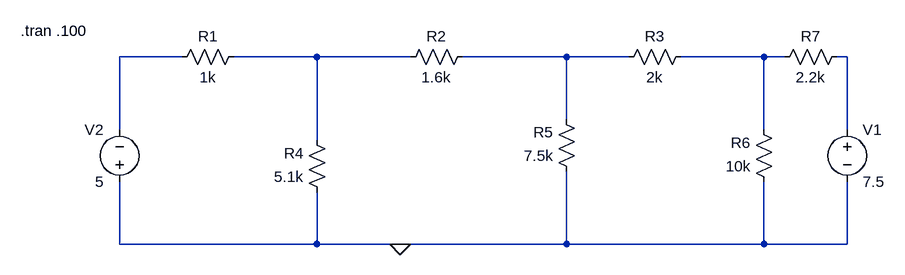
[diagram p0: schematic circuit2.asc]
circuit2.asc, the LTspice schematic file:
Version 4.1
SHEET 1 1008 680
WIRE -80 48 -176 48
WIRE 128 48 0 48
WIRE 272 48 128 48
WIRE 512 48 352 48
WIRE 608 48 512 48
WIRE 816 48 688 48
WIRE 848 48 816 48
WIRE 944 48 928 48
WIRE 512 144 512 48
WIRE -176 160 -176 48
WIRE 816 160 816 48
WIRE 944 160 944 48
WIRE 128 176 128 48
WIRE -176 336 -176 240
WIRE 128 336 128 256
WIRE 128 336 -176 336
WIRE 256 336 128 336
WIRE 512 336 512 224
WIRE 512 336 256 336
WIRE 816 336 816 240
WIRE 816 336 512 336
WIRE 944 336 944 240
WIRE 944 336 816 336
FLAG 256 336 0
SYMBOL res 16 32 R90
WINDOW 0 0 56 VBottom 2
WINDOW 3 32 56 VTop 2
SYMATTR InstName R1
SYMATTR Value 1k
SYMBOL res 368 32 R90
WINDOW 0 0 56 VBottom 2
WINDOW 3 32 56 VTop 2
SYMATTR InstName R2
SYMATTR Value 1.6k
SYMBOL res 704 32 R90
WINDOW 0 0 56 VBottom 2
WINDOW 3 32 56 VTop 2
SYMATTR InstName R3
SYMATTR Value 2k
SYMBOL res 144 272 R180
WINDOW 0 36 76 Left 2
WINDOW 3 36 40 Left 2
SYMATTR InstName R4
SYMATTR Value 5.1k
SYMBOL res 528 240 R180
WINDOW 0 36 76 Left 2
WINDOW 3 36 40 Left 2
SYMATTR InstName R5
SYMATTR Value 7.5k
SYMBOL res 832 256 R180
WINDOW 0 36 76 Left 2
WINDOW 3 36 40 Left 2
SYMATTR InstName R6
SYMATTR Value 10k
SYMBOL voltage 944 144 R0
WINDOW 123 0 0 Left 0
WINDOW 39 0 0 Left 0
SYMATTR InstName V1
SYMATTR Value 7.5
SYMBOL res 944 32 R90
WINDOW 0 0 56 VBottom 2
WINDOW 3 32 56 VTop 2
SYMATTR InstName R7
SYMATTR Value 2.2k
SYMBOL voltage -176 256 R180
WINDOW 0 24 96 Left 2
WINDOW 3 24 16 Left 2
WINDOW 123 0 0 Left 0
WINDOW 39 0 0 Left 0
SYMATTR InstName V2
SYMATTR Value 5
TEXT -328 8 Left 2 !.tran .100

The netlist it stands for:
* circuit2.asc
R1 N002 N001 1k
R2 N003 N002 1.6k
R3 N004 N003 2k
R4 0 N002 5.1k
R5 0 N003 7.5k
R6 0 N004 10k
V1 N005 0 7.5
R7 N005 N004 2.2k
V2 0 N001 5
.tran .100
.backanno
.end